# EasyEDA Pro project 自动分拣系统V1.epro

# Schematic Schematic1
Create Date: 2025-10-03; Page Name: P1; Project Name: 自动分拣系统; Schematic Name: Schematic1; Update Date: 2025-10-03; Company: 嘉立创EDA; Page Size: A4; Version: V1.0
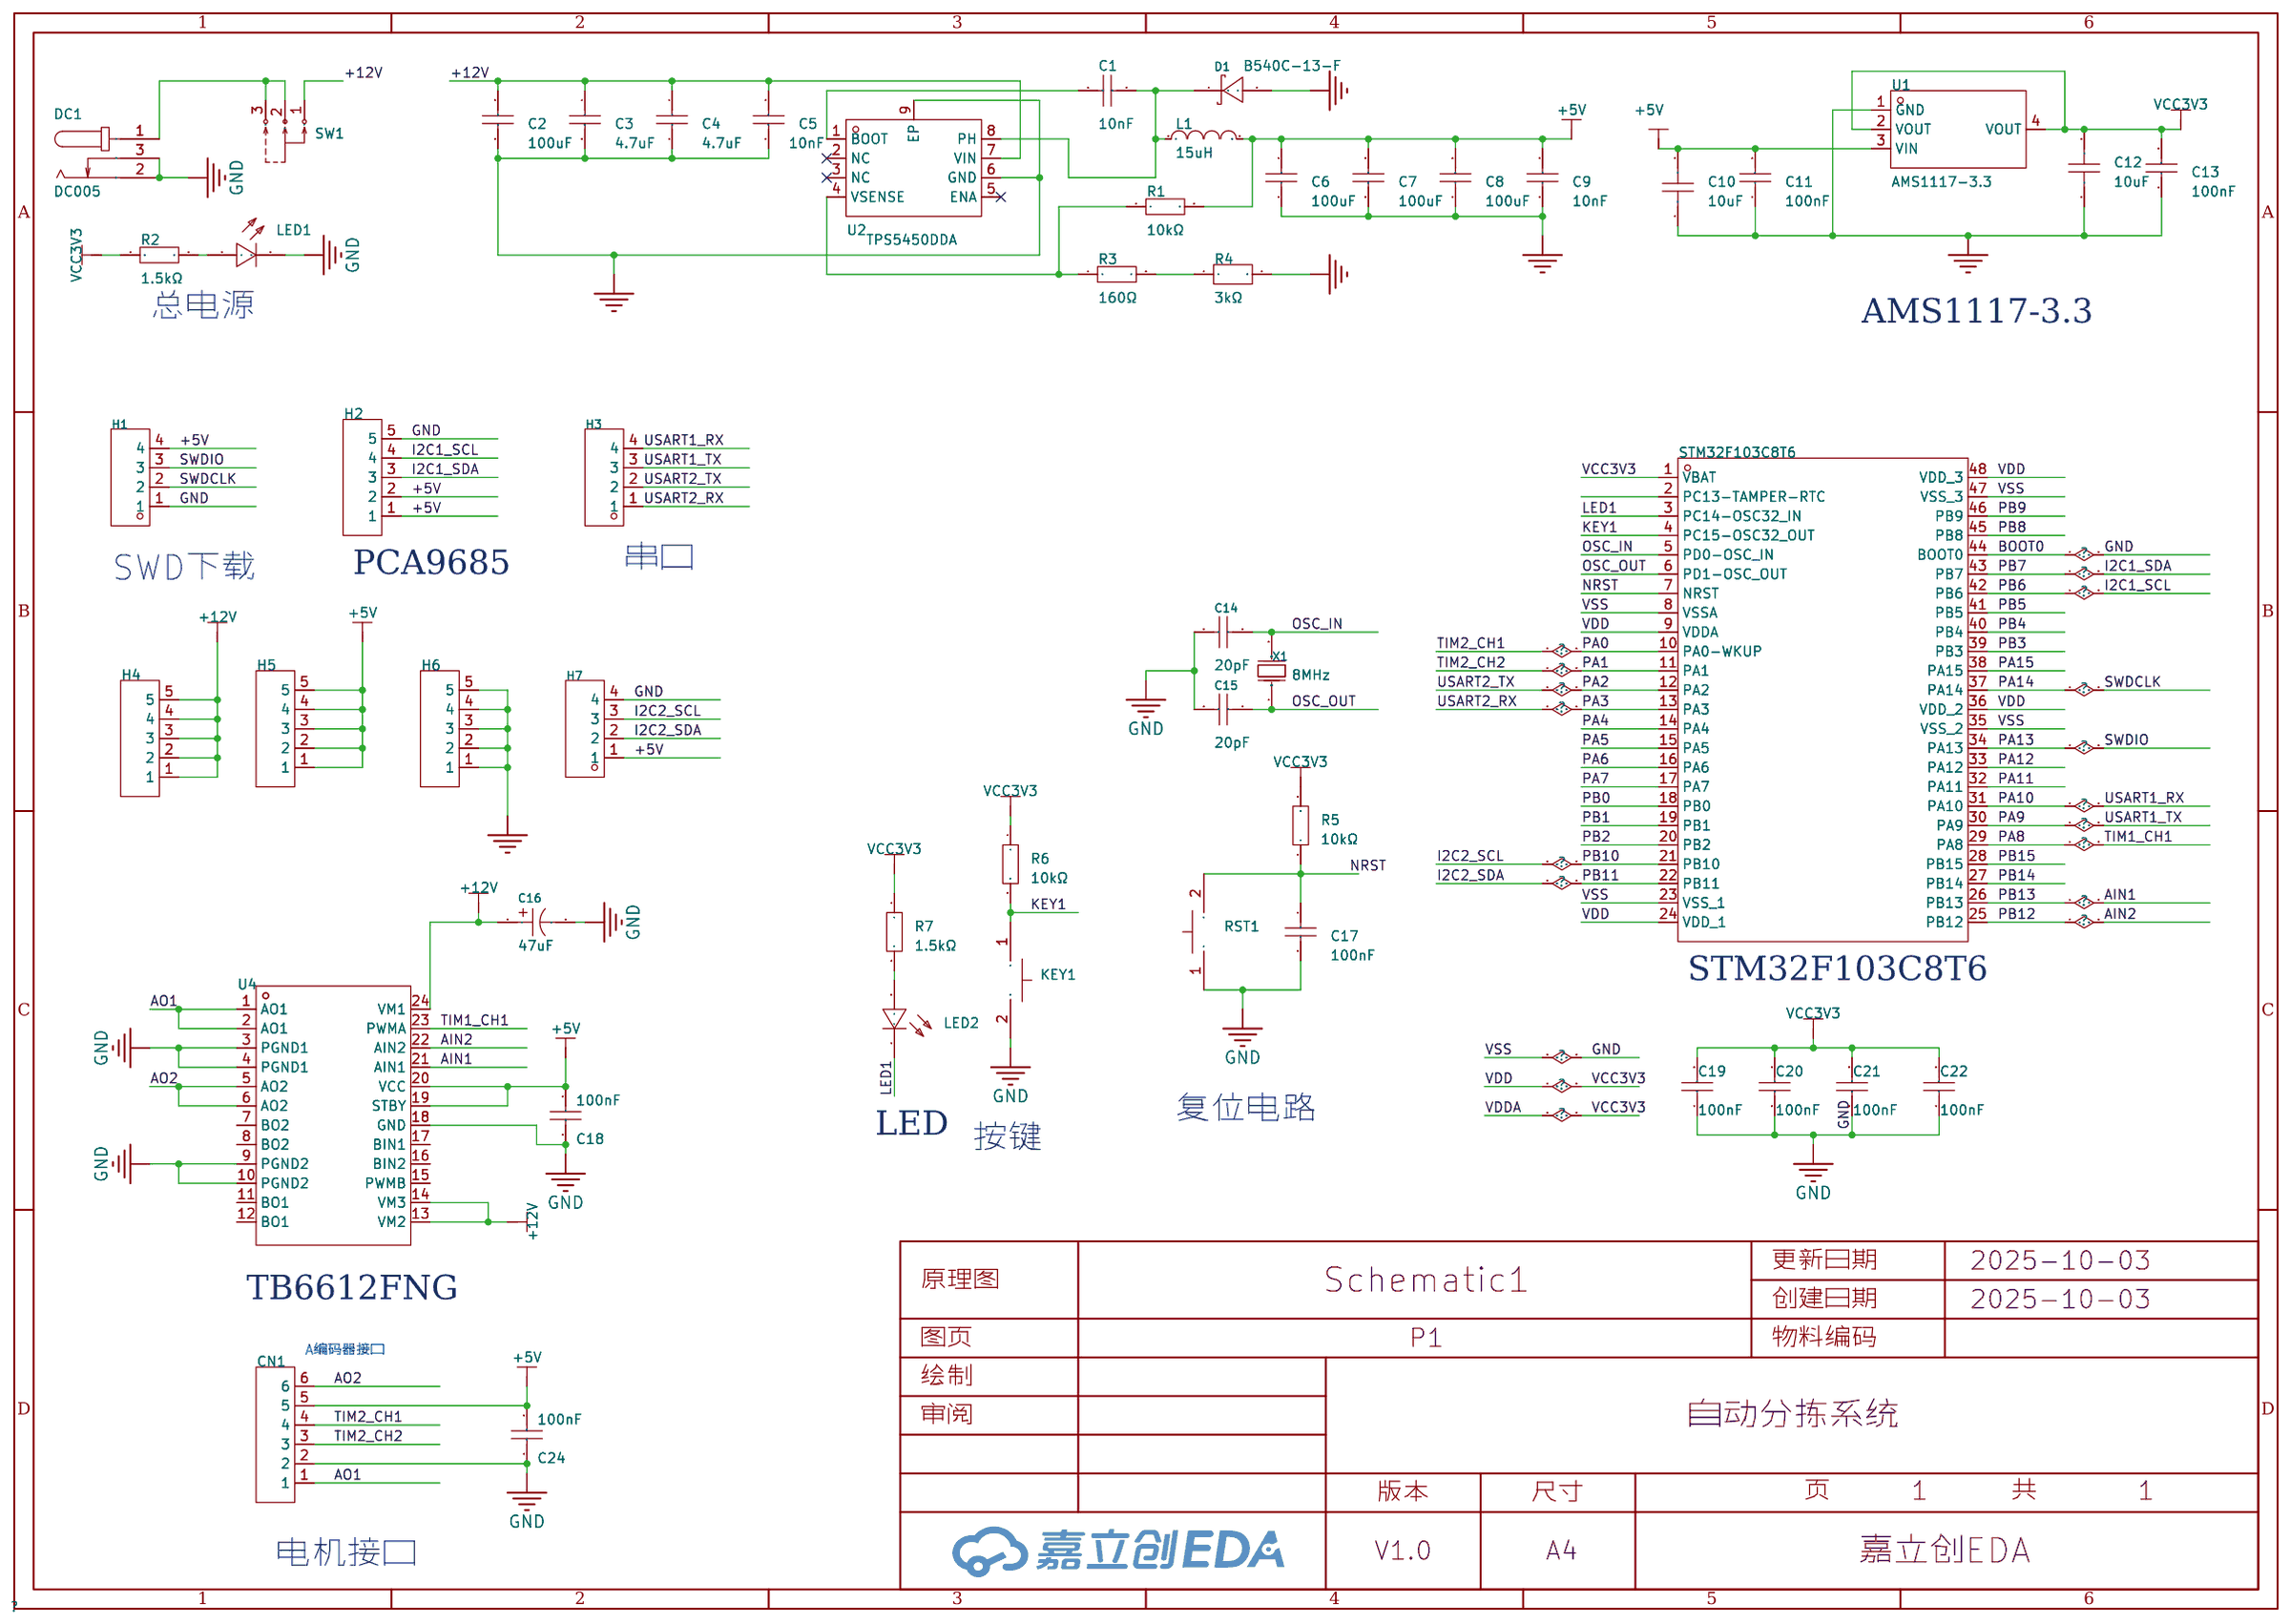
[diagram p0: schematic sheet]

## Parts
C1  10nF  [C0603]
C2  100uF  [C1206]
C3  4.7uF  [C0603]
C4  4.7uF  [C0603]
C5  10nF  [C0603]
C6  100uF  [C1206]
C7  100uF  [C1206]
C8  100uF  [C1206]
C9  10nF  [C0603]
C10  10uF  [C0603]
C11  100nF  [C0603]
C12  10uF  [C0603]
C13  100nF  [C0603]
C14  20pF  [C0603]
C15  20pF  [C0603]
C16  47uF  [CAP-SMD_BD6.3-L6.6-W6.6-LS7.2-FD]
C17  100nF  [C0603]
C18  100nF  [C0603]
C19  100nF  [C0603]
C20  100nF  [C0603]
C21  100nF  [C0603]
C22  100nF  [C0603]
C24  100nF  [C0603]
CN1  BX-PH2.0-6PWZ  [CONN-TH_6P-P2.00_BX-PH2.0-6PWZ]
D1  B540C-13-F  [SMC_L7.1-W6.2-LS8.1-RD]
DC1  DC005  [DC-IN-TH_DC005]
H1  PZ254V-11-04P  [HDR-TH_4P-P2.54-V-M]
H2  PZ254V-11-05P  [HDR-TH_5P-P2.54-V-M]
H3  PZ254V-11-04P  [HDR-TH_4P-P2.54-V-M]
H4  PZ254V-11-05P  [HDR-TH_5P-P2.54-V-M]
H5  PZ254V-11-05P  [HDR-TH_5P-P2.54-V-M]
H6  PZ254V-11-05P  [HDR-TH_5P-P2.54-V-M]
H7  PZ254V-11-04P  [HDR-TH_4P-P2.54-V-M]
KEY1  3*6*5贴片-2P  [SW-SMD_L6.0-W3.5-LS8.0]
L1  15uH  [IND-SMD_L7.0-W6.6_FXL0630]
LED1  NCD0603G1  [LED0603-RD]
LED2  NCD0603G1  [LED0603-RD]
R1  10kΩ  [R0603]
R2  1.5kΩ  [R0603]
R3  160Ω  [R0603]
R4  3kΩ  [R0603]
R5  10kΩ  [R0603]
R6  10kΩ  [R0603]
R7  1.5kΩ  [R0603]
RST1  3*6*5贴片-2P  [SW-SMD_L6.0-W3.5-LS8.0]
SW1  SS12D10/G5/直角  [SW-TH_SHOU-HAN_SS12D10G4]
U1  AMS1117-3.3  [SOT-223-3_L6.5-W3.4-P2.30-LS7.0-BR]
U2  TPS5450DDA  [SOP-8_L4.9-W3.9-P1.27-LS6.0-TL-EP-1]
U3  STM32F103C8T6  [LQFP-48_L7.0-W7.0-P0.50-LS9.0-BL]
U4  TB6612FNG,C,8,EL  [SSOP-24_L8.3-W5.6-P0.65-LS7.6-BL]
X1  8MHz  [CRYSTAL-SMD_4P-L3.2-W2.5-BL_SIT8008BI]

## Library data of the parts
C1 C5 C9 = CC0603KRX7R9BB103: 容值:10nF;精度:±10%;额定电压:50V;材质(温度系数):X7R;; LCSC Part Name: 10nF ±10% 50V; Supplier Part: C100042; Manufacturer: YAGEO(国巨); Supplier Footprint: 0603; JLCPCB Part Class: 扩展库; Datasheet: https://atta.szlcsc.com/upload/public/pdf/source/20181008/C309510_22F155564471FAF6A489F7D68F34234E.pdf; Supplier: LCSC; Tolerance: ±10%; Voltage Rated: 50V; Temperature Coefficient: X7R
C2 C6-C8 = CL31A107MQHNNNE: 容值:100uF;精度:±20%;额定电压:6.3V;材质(温度系数):X5R;; LCSC Part Name: 100uF ±20% 6.3V; Supplier Part: C15008; Manufacturer: SAMSUNG(三星); Supplier Footprint: 1206; JLCPCB Part Class: 基础库; Datasheet: https://atta.szlcsc.com/upload/public/pdf/source/20160218/1457707763339.pdf; Supplier: LCSC; Tolerance: ±20%; Voltage Rated: 6.3V; Temperature Coefficient: X5R
C3 C4 = CL10A475KA8NQNC: 容值:4.7uF;精度:±10%;额定电压:25V;材质(温度系数):X5R;; LCSC Part Name: 4.7uF ±10% 25V; Supplier Part: C69335; Manufacturer: SAMSUNG(三星); Supplier Footprint: 0603; JLCPCB Part Class: 扩展库; Datasheet: https://atta.szlcsc.com/upload/public/pdf/source/20161108/1478586410580.pdf; Supplier: LCSC; Tolerance: ±10%; Voltage Rated: 25V; Temperature Coefficient: X5R
C10 C12 = GRM21BR61H106KE43L: 容值:10uF;精度:±10%;额定电压:50V;材质(温度系数):X5R;; LCSC Part Name: 10uF ±10% 50V; Supplier Part: C440198; Manufacturer: muRata(村田); Supplier Footprint: 0805; JLCPCB Part Class: 基础库; Datasheet: https://atta.szlcsc.com/upload/public/pdf/source/20230811/95AAE0C9AF55EDC31B7A4D8B733F534E.pdf; Supplier: LCSC; Tolerance: ±10%; Voltage Rated: 50V; Temperature Coefficient: X5R
C11 C13 = 0603B104K500NT: 容值:100nF;精度:±10%;额定电压:50V;材质(温度系数):X7R;; LCSC Part Name: 100nF ±10% 50V; Supplier Part: C30926; Manufacturer: FH(风华); Supplier Footprint: 0603; JLCPCB Part Class: 扩展库; Datasheet: https://atta.szlcsc.com/upload/public/pdf/source/20200305/C486355_26A10D38EF8C2A5C37091D0039909270.pdf; Supplier: LCSC; Tolerance: ±10%; Voltage Rated: 50V; Temperature Coefficient: X7R
C14 C15 = CL10C200JB8NNNC: 容值:20pF;精度:±5%;额定电压:50V;材质(温度系数):C0G;; LCSC Part Name: 20pF ±5% 50V; Supplier Part: C1648; Manufacturer: SAMSUNG(三星); Supplier Footprint: 0603; JLCPCB Part Class: Basic Part; Datasheet: https://atta.szlcsc.com/upload/public/pdf/source/20160218/1457707763339.pdf; Supplier: LCSC; Tolerance: ±5%; Voltage Rated: 50V; Temperature Coefficient: C0G
C16 = RVT47UF35V67RV0039: 容值:47uF;额定电压:35V;电容体直径:-;电容体长度:-;纹波电流:-;等效串联电阻:-;工作寿命:2000hrs@105℃;; LCSC Part Name: 47uF 35V; Supplier Part: C2836440; Manufacturer: KNSCHA(科尼盛); Supplier Footprint: SMD,6.3x5.4mm; JLCPCB Part Class: 扩展库; Supplier: LCSC; Rated Voltage: 35V; Lifetime @ Temp: 2000hrs@105℃
C17 C18 C24 = 0603B104K500NT: 容值:100nF;精度:±10%;额定电压:50V;材质(温度系数):X7R;; LCSC Part Name: 100nF ±10% 50V; Supplier Part: C30926; Manufacturer: FH(风华); Supplier Footprint: 0603; JLCPCB Part Class: 扩展库; Datasheet: https://atta.szlcsc.com/upload/public/pdf/source/20170923/C30926_1506149436298988724.pdf; Supplier: LCSC; Tolerance: ±10%; Voltage Rated: 50V; Temperature Coefficient: X7R
C19-C22 = 0603B104K500NT: 容值:100nF;精度:±10%;额定电压:50V;材质(温度系数):X7R;; LCSC Part Name: 100nF ±10% 50V; Supplier Part: C30926; Manufacturer: FH(风华); Supplier Footprint: 0603; JLCPCB Part Class: Extended Part; Datasheet: https://atta.szlcsc.com/upload/public/pdf/source/20200305/C486355_26A10D38EF8C2A5C37091D0039909270.pdf; Supplier: LCSC; Tolerance: ±10%; Voltage Rated: 50V; Temperature Coefficient: X7R
CN1 = BX-PH2.0-6PWZ: 插针结构:1x6P;间距:2mm;安装方式:弯插;参考系列:PH;总PIN数:6P;排数:1;每排PIN数:6;行距:-;额定电流:2A;触头材质:黄铜;触头镀层:锡;工作温度:-25℃~+85℃;; LCSC Part Name: 1x6P 间距:2mm 弯插 系列:PH; Supplier Part: C18077757; Manufacturer: Bossie(博锡); Supplier Footprint: 弯插,P=2mm; JLCPCB Part Class: 扩展库; Datasheet: https://item.szlcsc.com/datasheet/BX-PH2.0-6PWZ/19218158.html; Supplier: LCSC; Pins Structure: 1x6P; Pitch: 2mm; Mounting Type: 弯插; Reference Series: PH; Number of Pins: 6P; Number of Rows: 1; Number of PINs Per Row: 6; Current Rating: 2A; Contact Material: 黄铜; Contact Plating: 锡; Operating Temperature: -25℃~+85℃; Voltage Rating: 250V; Plastic Material: PA66; Flame Retardant Rating: UL94V-0; Color: 白色; Z-Height of the Board: 4.7mm; X-Length of Bottom Edge on Board (Spacing Line): 14mm; Y-Width of Bottom Edge on Board: 6.05mm
D1 = B540C-13-F: 直流反向耐压(Vr):40V;平均整流电流(Io):5A;正向压降(Vf):550mV@5A;; LCSC Part Name: 电压:40V 电流:5A; Supplier Part: C72264; Manufacturer: DIODES(美台); Supplier Footprint: SMC(DO-214AB); JLCPCB Part Class: 扩展库; Datasheet: https://atta.szlcsc.com/upload/public/pdf/source/20171023/C134461_15087453602301052556.pdf; Supplier: LCSC; Reverse Voltage (Vr): 40V; Average Rectified Current (Io): 5A; Forward Voltage (Vf@If): 550mV@5A; Reverse Leakage Current (Ir): 500uA@40V
DC1 = DC005: 连接器类型:DC电源插座;安装方式:弯插;触点内径:2mm;触点外径:6.3mm;额定电流:500mA;额定电压:30V;工作温度范围:-40℃~+55℃;; LCSC Part Name: DC电源插座 内径:2mm 外径:6.3mm; Supplier Part: C431533; Manufacturer: SHOU HAN(首韩); Supplier Footprint: 插件; JLCPCB Part Class: 扩展库; Datasheet: https://atta.szlcsc.com/upload/public/pdf/source/20190925/C431533_4751811035784AC1D38EBC85F7905E99.pdf; Supplier: LCSC; Connector Type: DC电源插座; Mounting Style: 弯插; Inside Contact Diameter: 2mm; Outside Contact Diameter: 6.3mm; Current Rating (Max): 500mA; Voltage Rating (Max): 30V; Operating Temperature Range: -40℃~+55℃
H1 H3 H7 = PZ254V-11-04P: 排数:单排;总PIN位数:4P;间距:2.54mm;插针结构:1x4P;行距:-;安装类型:直插;圆针/方针:方针;额定电流:3A;额定电压:250V;配合针长度:6mm;塑高:2.5mm;端接针长度:3mm;触头材质:-;工作温度范围:-40℃~+105℃;颜色:黑色;; LCSC Part Name: 2.54mm 1x4P 直插 方针; Supplier Part: C2691448; Manufacturer: XFCN(兴飞); Supplier Footprint: 插件,P=2.54mm; JLCPCB Part Class: 扩展库; Datasheet: https://atta.szlcsc.com/upload/public/pdf/source/20200309/C492403_F9F19131791D08044AD4F84F8E751A34.pdf; Supplier: LCSC; Number of Rows: 单排; Number of Pins: 4P; Pitch: 2.54mm; Pin Structure: 1x4P; Mounting Type: 直插; Circluar Pins/Square Pins: 方针; Current Rating (Max): 3A; Voltage Rating (Max): 250V; Length of Mating Pin: 6mm; Insulation Height: 2.5mm; Length of End Connection Pin: 3mm; Operating Temperature Range: -40℃~+105℃; Color: 黑色
H2 H4-H6 = PZ254V-11-05P: 插针结构:1x5P;间距:2.54mm;行距:-;圆针/方针:方针;安装方式:直插;排数:单排;总PIN位数:5P;额定电流:-;额定电压:-;配合针长度:6mm;塑高:2.5mm;端接针长度:3mm;触头材质:黄铜;触头镀层:-;工作温度:-40℃~+105℃;颜色:黑色;; LCSC Part Name: 1x5P 间距:2.54mm 方针 直插; Supplier Part: C492404; Manufacturer: XFCN(兴飞); Supplier Footprint: 插件,P=2.54mm; JLCPCB Part Class: 扩展库; Datasheet: https://atta.szlcsc.com/upload/public/pdf/source/20200309/C492404_E51533260F8710EFF5D4617281164C1D.pdf; Supplier: LCSC; Pin Structure: 1x5P; Pitch: 2.54mm; Circluar Pins/Square Pins: 方针; Mounting Type: 直插; Number of Rows: 单排; Number of Pins: 5P; Length of Mating Pin: 6mm; Insulation Height: 2.5mm; Length of End Connection Pin: 3mm; Contact Material: 黄铜; Operating Temperature: -40℃~+105℃; Color: 黑色
KEY1 RST1 = 3*6*5贴片-2P: Supplier Part: C9900011307; Supplier Footprint: SW-SMD; JLCPCB Part Class: 扩展库; Supplier: LCSC
L1 = FXL0630-150-M: 电感值:15uH;精度:±20%;额定电流:3A;类型:一体成型电感;饱和电流(Isat):4.5A;; LCSC Part Name: 15uH ±20% 4.5A; Supplier Part: C177243; Manufacturer: cjiang(长江微电); Supplier Footprint: SMD,6.6x7mm; JLCPCB Part Class: 扩展库; Datasheet: https://atta.szlcsc.com/upload/public/pdf/source/20230516/3A080F5AF8C87BB81C3BA86E5F60E51A.pdf; Supplier: LCSC; Tolerance: ±20%; Rated Current: 3A; Type: 一体成型电感; DC Resistance (DCR): 115mΩ; Saturation Current (Isat): 4.5A
LED1 LED2 = NCD0603G1: 发光颜色:翠绿色;正向电压(VF):2.6V~3.6V;功率:72mW;正向电流:10mA;主波长:515nm~530nm;透镜颜色:无色透明;发光强度:330mcd~900mcd;发光角度:130°;工作温度:-30℃~+85℃;; Supplier Part: C84267; Manufacturer: 国星光电; Supplier Footprint: 0603; JLCPCB Part Class: 扩展库; Datasheet: https://atta.szlcsc.com/upload/public/pdf/source/20200820/C84267_04BA7703640BAC111D09F5EFB971FBF3.pdf; Supplier: LCSC; Emitted Color: 翠绿色; Forward Voltage (VF): 2.6V~3.6V; Power Dissipation: 72mW; Forward Current: 10mA; Dominant Wavelength: 515nm~530nm; Lens Color: 无色透明; Luminous Intensity: 330mcd~900mcd; Viewing Angle: 130°; Operating Temperature: -30℃~+85℃
R1 R5 R6 = 0603WAF1002T5E: 阻值:10kΩ;精度:±1%;功率:100mW;温度系数:±100ppm/℃;电阻类型:厚膜电阻;; LCSC Part Name: 10kΩ ±1% 100mW 厚膜电阻; Supplier Part: C25804; Manufacturer: UNI-ROYAL(厚声); Supplier Footprint: 0603; JLCPCB Part Class: 基础库; Datasheet: https://atta.szlcsc.com/upload/public/pdf/source/20200306/C422600_1E6D84923E4A46A82E41ADD87F860B5C.pdf; Supplier: LCSC; Tolerance: ±1%; Power(Watts): 100mW; Overload Voltage (Max): 75V; Temperature Coefficient: ±100ppm/℃; Type: 厚膜电阻; Operating Temperature Range: -55℃~+155℃
R2 R7 = 0603WAF1501T5E: 阻值:1.5kΩ;精度:±1%;功率:100mW;温度系数:±100ppm/℃;电阻类型:厚膜电阻;; LCSC Part Name: 1.5kΩ ±1% 100mW 厚膜电阻; Supplier Part: C22843; Manufacturer: UNI-ROYAL(厚声); Supplier Footprint: 0603; JLCPCB Part Class: 基础库; Datasheet: https://atta.szlcsc.com/upload/public/pdf/source/20200306/C422600_1E6D84923E4A46A82E41ADD87F860B5C.pdf; Supplier: LCSC; Tolerance: ±1%; Power(Watts): 100mW; Overload Voltage (Max): 75V; Temperature Coefficient: ±100ppm/℃; Type: 厚膜电阻; Operating Temperature Range: -55℃~+155℃
R3 = 0603WAF0000T5E: 阻值:0Ω;精度:±1%;功率:100mW;电阻类型:厚膜电阻;; LCSC Part Name: 0Ω ±1% 100mW 厚膜电阻; Supplier Part: C21189; Manufacturer: UNI-ROYAL(厚声); Supplier Footprint: 0603; JLCPCB Part Class: 基础库; Datasheet: https://atta.szlcsc.com/upload/public/pdf/source/20200306/C422600_1E6D84923E4A46A82E41ADD87F860B5C.pdf; Supplier: LCSC; Tolerance: ±1%; Power(Watts): 100mW; Overload Voltage (Max): 75V; Type: 厚膜电阻; Operating Temperature Range: -55℃~+155℃
R4 = FRC0603F3161TS: 阻值:3.16kΩ;精度:±1%;功率:100mW;温度系数:±100ppm/℃;电阻类型:厚膜电阻;; LCSC Part Name: 3.16kΩ ±1% 100mW 厚膜电阻; Supplier Part: C2930087; Manufacturer: FOJAN(富捷); Supplier Footprint: 0603; JLCPCB Part Class: 扩展库; Datasheet: https://atta.szlcsc.com/upload/public/pdf/source/20211221/925EC7D7225764EE0046F22065062C87.pdf; Supplier: LCSC; Tolerance: ±1%; Power(Watts): 100mW; Overload Voltage (Max): 75V; Temperature Coefficient: ±100ppm/℃; Type: 厚膜电阻; Operating Temperature Range: -55℃~+155℃
SW1 = SS12D10/G5/直角: Supplier Part: C9900029541; Supplier Footprint: THrough hole; JLCPCB Part Class: 扩展库; Supplier: LCSC
U1 = AMS1117-3.3_C6186: 输出类型:固定;最大输入电压:-;输出电压:3.3V;输出电流:1A;电源纹波抑制比(PSRR):72dB@(120Hz);输出极性:正;; LCSC Part Name: 输出3.3V 1A; Supplier Part: C6186; Manufacturer: AMS; Supplier Footprint: SOT-223-3; JLCPCB Part Class: 基础库; Datasheet: https://atta.szlcsc.com/upload/public/pdf/source/20180727/C6186_7A095716F0823C02F1997A905E26C086.pdf; Supplier: LCSC; Output Type: 固定; Output Voltage: 3.3V; Output Current: 1A; Power Supply Rejection Ratio (PSRR): 72dB@(120Hz); Dropout Voltage: 1.3V@(800mA); Output Polarity: 正; Number of Outputs: 1
U2 = TPS5450DDA: 功能类型:降压型;同步整流:否;输出类型:可调;输出通道数:1;拓扑结构:降压式;输入电压:5.5V~36V;输出电压:1.221V~31.32V;输出电流(最大值):5A;开关频率:500kHz;工作温度:-40℃~+125℃@(TJ);; LCSC Part Name: 降压型 Vin=5.5V~36V Vout=1.221V~31.32V 5A; Supplier Part: C1355315; Manufacturer: TI(德州仪器); Supplier Footprint: Power-Pad-SO-8; JLCPCB Part Class: 扩展库; Supplier: LCSC; Function: 降压型; Synchronous Rectification: 否; Output Type: 可调; Number of Outputs: 1; Topology: 降压式; Input Voltage: 5.5V~36V; Output Voltage: 1.221V~31.32V; Output Current (Max): 5A; Switching Frequency: 500kHz; Operating Temperature: -40℃~+125℃@(TJ)
U3 = STM32F103C8T6: CPU内核:ARM Cortex-M3;CPU最大主频:72MHz;程序存储容量:64KB;程序存储器类型:FLASH;RAM总容量:20KB;GPIO端口数量:37;ADC(位数):12bit;工作温度范围:-40℃~+85℃;; LCSC Part Name: ARM Cortex-M3 72MHz MSL=3; Supplier Part: C8734; Manufacturer: ST(意法半导体); Supplier Footprint: LQFP-48(7x7); JLCPCB Part Class: 基础库; Datasheet: https://atta.szlcsc.com/upload/public/pdf/source/20220812/8363ACEC51AD55ECEB84799464F7CB85.pdf; Supplier: LCSC; CPU Core: ARM Cortex-M3; CPU Maximum Speed: 72MHz; Operating Voltage Range: 2V~3.6V; Program Storage Size: 64KB; Program Memory Type: FLASH; RAM Size: 20KB; EEPROM: 64KB; GPIO Ports Number: 37; ADC (Bit): 12bit; Peripheral/Function: 看门狗；DMA；看门狗；片载温度传感器; Internal Oscillator: 有; Operating Temperature Range: -40℃~+85℃
U4 = TB6612FNG,C,8,EL: 类型:有刷直流电机;电源电压:2.7V~5.5V;输出电流:1A;接口:并行;; Supplier Part: C141517; Manufacturer: TOSHIBA(东芝); Supplier Footprint: SSOP-24; JLCPCB Part Class: 扩展库; Datasheet: https://atta.szlcsc.com/upload/public/pdf/source/20171128/C141517_15118625624231147036.pdf; Supplier: LCSC; Type: 有刷直流电机; Supply Voltage: 2.7V~5.5V; Output Current: 1A; Interface: 并行; Operating Temperature: -20℃~+85℃@(Ta)
X1 = X49SD8MSD2SC: 晶振类型:直插晶振;频率:8MHz;常温频差:±20ppm;外接负载电容:20pF;频率稳定度(全温):±30ppm;; LCSC Part Name: 8MHz ±20ppm 20pF; Supplier Part: C21263; Manufacturer: YXC(扬兴晶振); Supplier Footprint: HC-49S; JLCPCB Part Class: Extended Part; Datasheet: https://atta.szlcsc.com/upload/public/pdf/source/20210903/A997D130AE99CBB55D9024F9BE6DA174.pdf; Supplier: LCSC; Crystal Type: 直插晶振; Normal temperature Frequency Tolerance: ±20ppm; External load capacitor: 20pF; Frequency Stability(Full temperature range): ±30ppm; Operating Temperature: -20℃~+70℃; Frequency Tolerance: ±10ppm; Frequency Stability: ±50ppm; Load Capacitance: 20pF

## Nets
+5V: C6.2 C7.2 C8.2 C9.2 C10.2 C11.2 C18.1 C24.1 CN1.5 H1.4 H2.1 H2.2 H5.1 H5.2 H5.3 H5.4 H5.5 H7.1 L1.2 R1.2 U1.3(VIN) U4.19(STBY) U4.20(VCC)
+12V: C2.2 C3.1 C4.1 C5.2 C16.1 H4.1 H4.2 H4.3 H4.4 H4.5 SW1.1 U2.7(VIN) U4.13(VM2) U4.14(VM3) U4.24(VM1)
GND: C2.1 C3.2 C4.2 C5.1 C6.1 C7.1 C8.1 C9.1 C10.1 C11.1 C12.1 C13.1 C14.2 C15.2 C16.2 C17.2 C18.2 C19.1 C20.1 C21.1 C22.1 C24.2 CN1.2 D1.2(A) DC1.2 DC1.3 H1.1 H2.5 H6.1 H6.2 H6.3 H6.4 H6.5 H7.4 KEY1.2 LED1.1(K) R4.2 RST1.1 U1.1(GND) U2.6(GND) U2.9(EP) U3.8(VSSA) U3.23(VSS_1) U3.35(VSS_2) U3.44(BOOT0) U3.47(VSS_3) U4.3(PGND1) U4.4(PGND1) U4.9(PGND2) U4.10(PGND2) U4.18(GND)
VCC3V3: C12.2 C13.2 C19.2 C20.2 C21.2 C22.2 R2.1 R5.2 R6.1 R7.1 U1.2(VOUT) U1.4(VOUT) U3.1(VBAT) U3.9(VDDA) U3.24(VDD_1) U3.36(VDD_2) U3.48(VDD_3)
AIN1: U3.26(PB13) U4.21(AIN1)
AIN2: U3.25(PB12) U4.22(AIN2)
AO1: CN1.1 U4.1(AO1) U4.2(AO1)
AO2: CN1.6 U4.5(AO2) U4.6(AO2)
I2C1_SCL: H2.4 U3.42(PB6)
I2C1_SDA: H2.3 U3.43(PB7)
I2C2_SCL: H7.3 U3.21(PB10)
I2C2_SDA: H7.2 U3.22(PB11)
KEY1: KEY1.1 R6.2 U3.4(PC15-OSC32_OUT)
LED1: LED2.1(K) U3.3(PC14-OSC32_IN)
NRST: C17.1 R5.1 RST1.2 U3.7(NRST)
OSC_IN: C14.1 U3.5(PD0-OSC_IN) X1.2(OSC2)
OSC_OUT: C15.1 U3.6(PD1-OSC_OUT) X1.1(OSC1)
PA0: CN1.4 U3.10(PA0-WKUP)
PA1: CN1.3 U3.11(PA1)
PA2: H3.2 U3.12(PA2)
PA3: H3.1 U3.13(PA3)
PA4: U3.14(PA4)
PA5: U3.15(PA5)
PA6: U3.16(PA6)
PA7: U3.17(PA7)
PA8: U3.29(PA8) U4.23(PWMA)
PA9: H3.3 U3.30(PA9)
PA10: H3.4 U3.31(PA10)
PA11: U3.32(PA11)
PA12: U3.33(PA12)
PA13: H1.3 U3.34(PA13)
PA14: H1.2 U3.37(PA14)
PA15: U3.38(PA15)
PB0: U3.18(PB0)
PB1: U3.19(PB1)
PB2: U3.20(PB2)
PB3: U3.39(PB3)
PB4: U3.40(PB4)
PB5: U3.41(PB5)
PB8: U3.45(PB8)
PB9: U3.46(PB9)
PB14: U3.27(PB14)
PB15: U3.28(PB15)
$1N3060: LED1.2(A) R2.2
$1N3483: LED2.2(A) R7.2
$1N5689: R3.2 R4.1
$1N5690: R1.1 R3.1 U2.4(VSENSE)
$1N5697: C1.2 U2.1(BOOT)
$1N5698: C1.1 D1.1(K) L1.1 U2.8(PH)
$1N11600: DC1.1 SW1.2 SW1.3

Not connected (* = marked no-connect by the designer): U2 2(NC)* 3(NC)* 5(ENA)*; U3 2(PC13-TAMPER-RTC); U4 7(BO2) 8(BO2) 11(BO1) 12(BO1) 15(PWMB) 16(BIN2) 17(BIN1)

## Notes on the sheet
- 总电源
- AMS1117-3.3
- SWD下载
- PCA9685
- 串口
- STM32F103C8T6
- 复位电路
- LED
- 按键
- TB6612FNG
- A编码器接口
- 电机接口

# Board PCB1
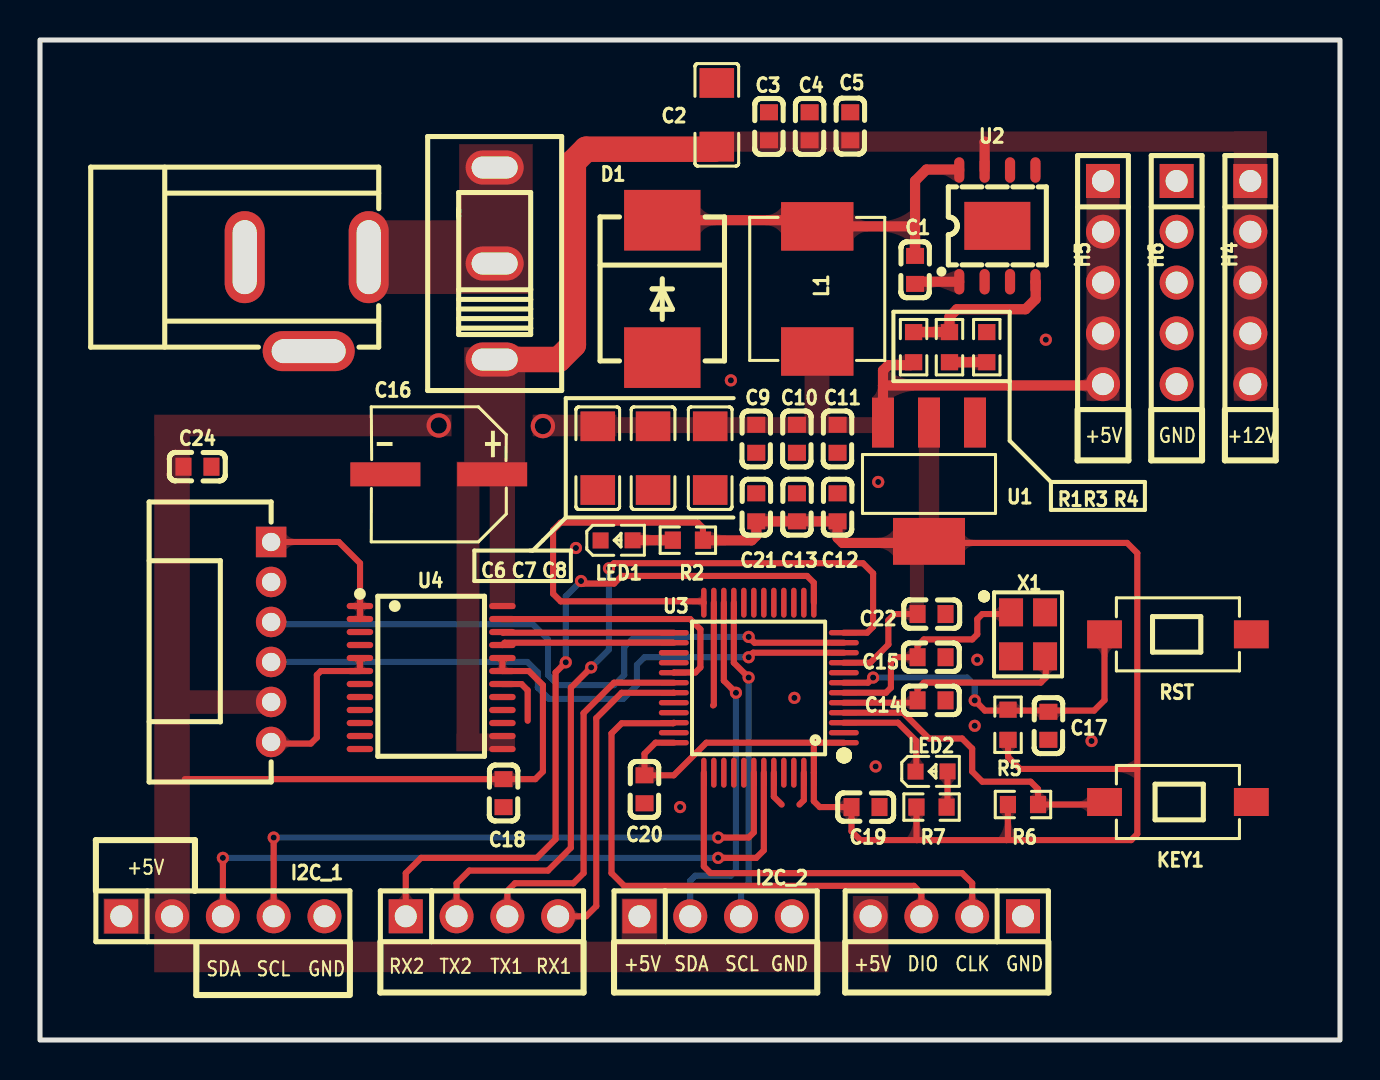
[diagram p1: board, top side]
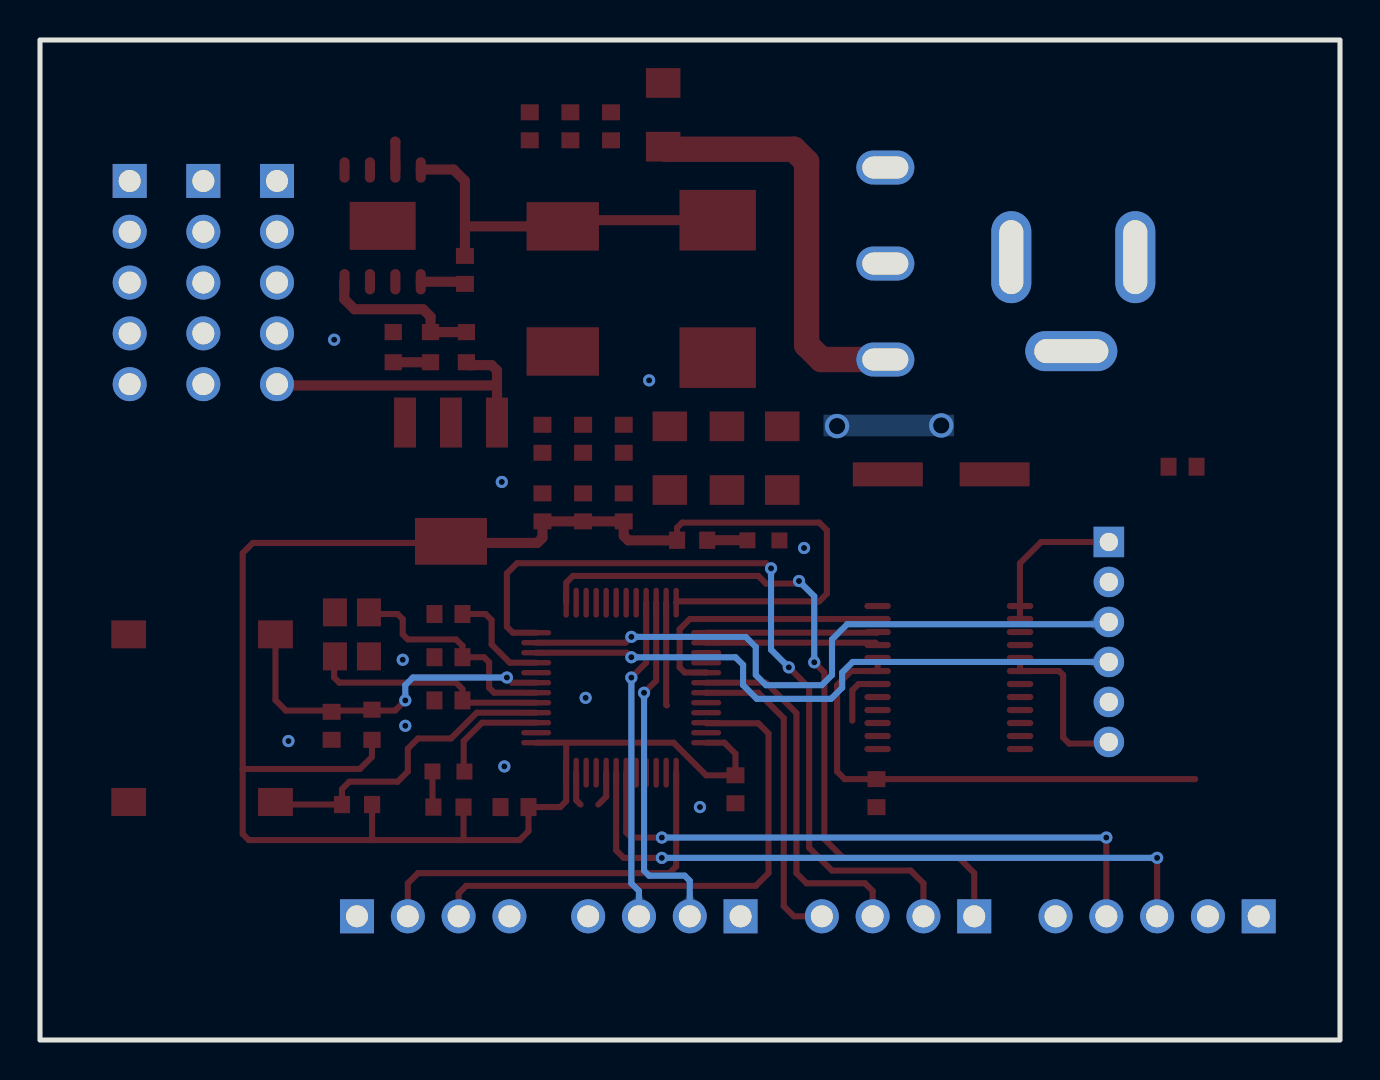
[diagram p2: board, bottom side, seen from below]

Outline 65 x 50 mm; copper layers: Top Layer, Bottom Layer. Coordinates in mm from the lower left corner of the outline.
Outline path: rectangle 0,50 65,0
Stack: Top Layer 0.035mm / Dielectric1 1.51mm FR4 er 4.5 / Bottom Layer 0.035mm

## Design rules (mm)
template: JLCPCB Capability(Two Layers Board)
spacing copperThickness1oz (default): track to track 0.102, other pairs 0.152 to 0.3
spacing copperThickness2oz: track to track 0.203, other pairs 0.152 to 0.3
track width copperThickness1oz (default): min 0.127, default 0.254, max 2.54
track width copperThickness2oz: min 0.203, default 0.254, max 2.54
differential pair differentialPair (default): width min 0.127, default 0.254, max 2.54; gap min 0.152, default 0.152
via viaSize (default): diameter min 0.5, default 0.61, max 10; hole min 0.3, default 0.305, max 6.3

## Placement (name value [footprint] x y rotation side)
C1  10nF  [C0603]  43.75 38.5 270 top
C2  100uF  [C1206]  33.84 46.26 270 top
C3  4.7uF  [C0603]  36.45 45.68 90 top
C4  4.7uF  [C0603]  38.48 45.68 90 top
C5  10nF  [C0603]  40.51 45.68 270 top
C6  100uF  [C1206]  27.89 29.09 90 top
C7  100uF  [C1206]  30.65 29.09 90 top
C8  100uF  [C1206]  33.51 29.09 90 top
C9  10nF  [C0603]  35.81 30.06 90 top
C10  10uF  [C0603]  37.85 30.06 90 top
C11  100nF  [C0603]  39.88 30.06 90 top
C12  10uF  [C0603]  39.88 26.63 270 top
C13  100nF  [C0603]  37.85 26.63 270 top
C14  20pF  [C0603]  44.58 16.98 0 top
C15  20pF  [C0603]  44.58 19.14 0 top
C16  47uF  [CAP-SMD_BD6.3-L6.6-W6.6-LS7.2-FD]  19.94 28.28 180 top
C17  100nF  [C0603]  50.42 15.71 270 top
C18  100nF  [C0603]  23.18 12.34 270 top
C19  100nF  [C0603]  41.27 11.65 180 top
C20  100nF  [C0603]  30.23 12.53 90 top
C21  100nF  [C0603]  35.81 26.63 270 top
C22  100nF  [C0603]  44.58 21.3 180 top
C24  100nF  [C0603]  7.87 28.66 0 top
CN1  BX-PH2.0-6PWZ  [CONN-TH_6P-P2.00_BX-PH2.0-6PWZ]  11.56 19.9 270 top
D1  B540C-13-F  [SMC_L7.1-W6.2-LS8.1-RD]  31.11 37.55 270 top
DC1  DC005  [DC-IN-TH_DC005]  13.34 36.79 0 top
H4  PZ254V-11-05P  [HDR-TH_5P-P2.54-V-M]  60.52 37.87 270 top
H5  PZ254V-11-05P  [HDR-TH_5P-P2.54-V-M]  53.15 37.87 270 top
H6  PZ254V-11-05P  [HDR-TH_5P-P2.54-V-M]  56.83 37.87 270 top
I2C_1  PZ254V-11-05P  [HDR-TH_5P-P2.54-V-M]  9.14 6.18 0 top
I2C_2  PZ254V-11-04P  [HDR-TH_4P-P2.54-V-M]  33.78 6.18 0 top
KEY1  3*6*5贴片-2P  [SW-SMD_L6.0-W3.5-LS8.0]  56.9 11.9 0 top
L1  15uH  [IND-SMD_L7.0-W6.6_FXL0630]  38.86 37.55 90 top
LED1  NCD0603G1  [LED0603-RD]  28.83 24.98 0 top
LED2  NCD0603G1  [LED0603-RD]  44.58 13.42 0 top
NOREF  -  [HDR-TH_4P-P2.54-V-M]  45.34 6.18 180 top
R1  10kΩ  [R0603]  43.68 34.64 270 top
R2  1.5kΩ  [R0603]  32.39 24.99 180 top
R3  160Ω  [R0603]  45.47 34.64 270 top
R4  3kΩ  [R0603]  47.34 34.64 90 top
R5  10kΩ  [R0603]  48.4 15.76 270 top
R6  10kΩ  [R0603]  49.15 11.77 0 top
R7  1.5kΩ  [R0603]  44.58 11.65 0 top
RST  3*6*5贴片-2P  [SW-SMD_L6.0-W3.5-LS8.0]  56.9 20.28 180 top
SW1  SS12D10/G5/直角  [SW-TH_SHOU-HAN_SS12D10G4]  22.73 38.82 90 top
U1  AMS1117-3.3  [SOT-223-3_L6.5-W3.4-P2.30-LS7.0-BR]  44.45 27.9 90 top
U2  TPS5450DDA  [SOP-8_L4.9-W3.9-P1.27-LS6.0-TL-EP-1]  47.87 40.71 90 top
U3  STM32F103C8T6  [LQFP-48_L7.0-W7.0-P0.50-LS9.0-BL]  35.94 17.61 90 top
U4  TB6612FNG,C,8,EL  [SSOP-24_L8.3-W5.6-P0.65-LS7.6-BL]  19.56 18.12 270 top
X1  8MHz  [CRYSTAL-SMD_4P-L3.2-W2.5-BL_SIT8008BI]  49.4 20.28 270 top
串口  PZ254V-11-04P  [HDR-TH_4P-P2.54-V-M]  22.1 6.18 0 top

## Footprints (pads in the part's own frame, mm; a bottom-side part is the same pattern mirrored in y, then rotated)
C0603
  rect 0.8x0.9 smd: 1(-0.7,0) 2(0.7,0)
C1206
  rect 1.485x1.728 smd: 1(-1.593,0) 2(1.593,0)
CAP-SMD_BD6.3-L6.6-W6.6-LS7.2-FD
  rect 3.5x1.2 smd: 1(-2.67,0) 2(2.67,0)
CONN-TH_6P-P2.00_BX-PH2.0-6PWZ
  rect 1.524x1.524 hole 0.914: 1(-5,0)
  round 1.524 hole 0.914: 2(-3,0) 3(-1,0) 4(1,0) 5(3,0) 6(5,0)
CRYSTAL-SMD_4P-L3.2-W2.5-BL_SIT8008BI
  rect 1.4x1.2 smd: 1(-1.1,-0.85) 2(1.1,-0.85) 3(1.1,0.85) 4(-1.1,0.85)
DC-IN-TH_DC005
  oval 2x4.6 hole 1.2x3.7: 1(3.1,2.35) 2(-3.1,2.35)
  oval 4.6x2 hole 3.7x1.2: 3(0.1,-2.35)
HDR-TH_4P-P2.54-V-M
  rect 1.7x1.7 hole 1.1: 1(-3.81,0)
  round 1.7 hole 1.1: 2(-1.27,0) 3(1.27,0) 4(3.81,0)
HDR-TH_5P-P2.54-V-M
  rect 1.7x1.7 hole 1.1: 1(-5.08,0)
  round 1.7 hole 1.1: 2(-2.54,0) 3(0,0) 4(2.54,0) 5(5.08,0)
IND-SMD_L7.0-W6.6_FXL0630
  rect 2.424x3.62 smd: 1(3.128,0) 2(-3.128,0)
LED0603-RD
  rect 0.8x0.8 smd: 1(-0.799,-0.004) 2(0.799,0.004)
LQFP-48_L7.0-W7.0-P0.50-LS9.0-BL
  oval 0.27x1.5 smd: 1(-2.75,-4.25) 2(-2.25,-4.25) 3(-1.75,-4.25) 4(-1.25,-4.25) 5(-0.75,-4.25) 6(-0.25,-4.25) 7(0.25,-4.25) 8(0.75,-4.25) 9(1.25,-4.25) 10(1.75,-4.25) 11(2.25,-4.25) 12(2.75,-4.25) 25(2.75,4.25) 26(2.25,4.25) 27(1.75,4.25) 28(1.25,4.25) 29(0.75,4.25) 30(0.25,4.25) 31(-0.25,4.25) 32(-0.75,4.25) 33(-1.25,4.25) 34(-1.75,4.25) 35(-2.25,4.25) 36(-2.75,4.25)
  oval 1.5x0.27 smd: 13(4.25,-2.75) 14(4.25,-2.25) 15(4.25,-1.75) 16(4.25,-1.25) 17(4.25,-0.75) 18(4.25,-0.25) 19(4.25,0.25) 20(4.25,0.75) 21(4.25,1.25) 22(4.25,1.75) 23(4.25,2.25) 24(4.25,2.75) 37(-4.25,2.75) 38(-4.25,2.25) 39(-4.25,1.75) 40(-4.25,1.25) 41(-4.25,0.75) 42(-4.25,0.25) 43(-4.25,-0.25) 44(-4.25,-0.75) 45(-4.25,-1.25) 46(-4.25,-1.75) 47(-4.25,-2.25) 48(-4.25,-2.75)
R0603
  rect 0.806x0.864 smd: 1(-0.753,0) 2(0.753,0)
SMC_L7.1-W6.2-LS8.1-RD
  rect 3.03x3.82 smd: 1(-3.435,0) 2(3.435,0)
SOP-8_L4.9-W3.9-P1.27-LS6.0-TL-EP-1
  oval 1.27x0.508 smd: 1(-2.794,1.905) 2(-2.794,0.635) 3(-2.794,-0.635) 4(-2.794,-1.905) 5(2.794,-1.905) 6(2.794,-0.635) 7(2.794,0.635) 8(2.794,1.905)
  rect 2.4x3.3 smd: 9(0,0)
SOT-223-3_L6.5-W3.4-P2.30-LS7.0-BR
  rect 2.5x1.1 smd: 1(2.97,-2.3) 2(2.97,0) 3(2.97,2.3)
  rect 2.34x3.6 smd: 4(-2.97,0)
SSOP-24_L8.3-W5.6-P0.65-LS7.6-BL
  oval 0.308x1.324 smd: 1(-3.575,-3.562) 2(-2.925,-3.562) 3(-2.275,-3.562) 4(-1.625,-3.562) 5(-0.975,-3.562) 6(-0.325,-3.562) 7(0.325,-3.562) 8(0.975,-3.562) 9(1.625,-3.562) 10(2.275,-3.562) 11(2.925,-3.562) 12(3.575,-3.562) 13(3.575,3.562) 14(2.925,3.562) 15(2.275,3.562) 16(1.625,3.562) 17(0.975,3.562) 18(0.325,3.562) 19(-0.325,3.562) 20(-0.975,3.562) 21(-1.625,3.562) 22(-2.275,3.562) 23(-2.925,3.562) 24(-3.575,3.562)
SW-SMD_L6.0-W3.5-LS8.0
  rect 1.74x1.4 smd: 1(-3.67,0) 2(3.67,0)
SW-TH_SHOU-HAN_SS12D10G4
  oval 1.7x2.9 hole 1.1x2.3: 1(-4.8,0) 2(0,0) 3(4.8,0)

## Nets
+5V: C6.2 C7.2 C8.2 C9.2 C10.2 C11.2 C18.1 C24.1 CN1.5 H5.1 H5.2 H5.3 H5.4 H5.5 I2C_1.1 I2C_1.2 I2C_2.1 L1.2 NOREF.4 R1.2 U1.3 U4.19 U4.20
+12V: C2.2 C3.1 C4.1 C5.2 C16.1 H4.1 H4.2 H4.3 H4.4 H4.5 SW1.1 U2.7 U4.13 U4.14 U4.24
GND: C2.1 C3.2 C4.2 C5.1 C6.1 C7.1 C8.1 C9.1 C10.1 C11.1 C12.1 C13.1 C14.2 C15.2 C16.2 C17.2 C18.2 C19.1 C20.1 C21.1 C22.1 C24.2 CN1.2 D1.2 DC1.2 DC1.3 H6.1 H6.2 H6.3 H6.4 H6.5 I2C_1.5 I2C_2.4 KEY1.2 LED1.1 NOREF.1 R4.2 RST.1 U1.1 U2.6 U2.9 U3.8 U3.23 U3.35 U3.44 U3.47 U4.3 U4.4 U4.9 U4.10 U4.18
VCC3V3: C12.2 C13.2 C19.2 C20.2 C21.2 C22.2 R2.1 R5.2 R6.1 R7.1 U1.2 U1.4 U3.1 U3.9 U3.24 U3.36 U3.48
AIN1: U3.26 U4.21
AIN2: U3.25 U4.22
AO1: CN1.1 U4.1 U4.2
AO2: CN1.6 U4.5 U4.6
I2C1_SCL: I2C_1.4 U3.42
I2C1_SDA: I2C_1.3 U3.43
I2C2_SCL: I2C_2.3 U3.21
I2C2_SDA: I2C_2.2 U3.22
KEY1: KEY1.1 R6.2 U3.4
LED1: LED2.1 U3.3
NRST: C17.1 R5.1 RST.2 U3.7
OSC_IN: C14.1 U3.5 X1.3
OSC_OUT: C15.1 U3.6 X1.1
PA0: CN1.4 U3.10
PA1: CN1.3 U3.11
PA2: U3.12 串口.2
PA3: U3.13 串口.1
PA4: U3.14
PA5: U3.15
PA6: U3.16
PA7: U3.17
PA8: U3.29 U4.23
PA9: U3.30 串口.3
PA10: U3.31 串口.4
PA11: U3.32
PA12: U3.33
PA13: NOREF.3 U3.34
PA14: NOREF.2 U3.37
PA15: U3.38
PB0: U3.18
PB1: U3.19
PB2: U3.20
PB3: U3.39
PB4: U3.40
PB5: U3.41
PB8: U3.45
PB9: U3.46
PB14: U3.27
PB15: U3.28
$1N3060: LED1.2 R2.2
$1N3483: LED2.2 R7.2
$1N5689: R3.2 R4.1
$1N5690: R1.1 R3.1 U2.4
$1N5697: C1.2 U2.1
$1N5698: C1.1 D1.1 L1.1 U2.8
$1N7426: U3.2
$1N11600: DC1.1 SW1.2 SW1.3

Pads without a net: U2 2 3 5; U4 7 8 11 12 15 16 17; X1 2 4

## Via types
v1: diameter 0.61, hole 0.305, Top Layer to Bottom Layer, 24 vias
v2: diameter 1.219, hole 0.813, Top Layer to Bottom Layer, 2 vias

## Routing (per net, layer and track width the routed paths; a pad name or vN(x,y) marks a point on that pad's centre or on a via; arc(x,y) is an arc through that point)
+5V: length 40.3
  Top Layer w0.305: U4.20 U4.19 24.44,18.45 25.15,17.74 25.15,13.42 24.77,13.04 C18.1 7.24,13.04
  Top Layer w0.508: 42.15,32.73 42.15,33.48 42.42,33.74 43.54,33.74 R1.2 ; 42.15,32.73 U1.3 ; 42.15,32.73 52.83,32.73
  vias: v2(19.94,30.73) v2(25.15,30.7)
+12V: length 22.3
  Top Layer w0.508: 47.24,44.92 47.23,44.91 U2.7
  Top Layer w1.27: C2.2 33.71,44.54 27.3,44.54 26.67,43.9 26.67,34.76 25.93,34.02 SW1.1
GND: length 11.5
  Top Layer w0.305: U4.18 24.07,17.8 24.38,17.49 24.38,15.96 ; 37.08,11.77 36.69,12.17 U3.44 ; 33.66,16.73 33.69,16.76 U3.23 ; 37.97,11.77 38.19,11.99 U3.47
  vias: v1(26.8,24.6) v1(32,11.65) v1(34.54,32.98) v1(37.72,17.11) v1(41.78,13.68) v1(41.91,27.9) v1(46.74,15.71) v1(46.86,19.01) v1(50.29,35.01) v1(52.58,14.95)
VCC3V3: length 107.4
  Top Layer w0.305: R2.1 33.15,25.62 32.89,25.87 26.04,25.87 25.65,25.49 25.65,22.31 26.04,21.93 33.12,21.93 U3.24 ; 43.84,9.99 41.02,9.99 40.58,10.44 C19.2 38.99,11.65 38.69,11.94 U3.48 38.69,14.65 ; 43.84,9.99 43.82,10.01 R7.1 ; 43.84,9.99 48.32,9.99 ; 54.86,13.55 49.01,13.55 48.4,14.15 R5.2 ; 54.86,13.55 54.86,10.3 54.56,9.99 48.32,9.99 ; 54.86,13.55 54.86,24.35 54.36,24.85 44.53,24.85 U1.4 ; R6.1 48.4,10.07 48.32,9.99 ; U3.9 41.51,18.86 42.42,19.77 42.42,20.99 42.72,21.3 43.88,21.3 ; U3.1 33.32,14.86 31.69,13.23 C20.2 30.23,14.31 30.78,14.86 U3.36
  Top Layer w0.508: R2.1 33.16,24.98 35.58,24.98 35.81,25.21 C21.2 C13.2 C12.2 39.88,25.11 40.13,24.85 44.37,24.85 U1.4
AIN1: length 8.6
  Top Layer w0.305: U3.26 23.24,19.86 U4.21
AIN2: length 8.6
  Top Layer w0.305: U4.22 23.15,20.36 U3.25
AO1: length 7.7
  Top Layer w0.305: CN1.1 14.94,24.9 16,23.84 16,21.05 16,21.05
AO2: length 8.4
  Top Layer w0.305: U4.5 U4.6 14.04,18.45 13.84,18.25 13.84,15.12 13.54,14.82 11.56,14.82
I2C1_SCL: length 31
  Top Layer w0.305: U3.42 35.69,10.38 35.43,10.12 v1(33.91,10.12) ; v1(11.68,10.12) I2C_1.4
  Bottom Layer w0.305: v1(11.68,10.12) v1(33.91,10.12)
I2C1_SDA: length 34
  Top Layer w0.305: U3.43 36.19,9.48 35.81,9.11 v1(33.91,9.11) ; v1(9.14,9.11) I2C_1.3
  Bottom Layer w0.305: v1(9.14,9.11) v1(33.91,9.11)
I2C2_SCL: length 16.1
  Top Layer w0.305: U3.21 34.69,18.86 v1(35.43,18.12)
  Bottom Layer w0.305: v1(35.43,18.12) 35.43,7.84 35.05,7.45 I2C_2.3
I2C2_SDA: length 17.9
  Top Layer w0.305: U3.22 34.19,17.97 v1(34.8,17.36)
  Bottom Layer w0.305: I2C_2.2 32.51,7.96 32.77,8.22 34.54,8.22 34.8,8.47 v1(34.8,17.36)
KEY1: length 16.1
  Top Layer w0.305: KEY1.1 53.1,11.77 R6.2 49.9,12.54 49.53,12.92 47.12,12.92 46.61,13.42 46.61,14.57 46.1,15.07 44.45,15.07 43.16,16.36 U3.4
LED1: length 5.5
  Top Layer w0.305: U3.3 42.9,15.86 43.82,14.95 43.82,13.46 LED2.1
NRST: length 17.6
  Top Layer w0.305: U3.7 41.4,17.86 v1(41.66,18.12) ; v1(46.74,16.98) 47.24,16.47 52.7,16.47 53.23,16.99 RST.2
  Bottom Layer w0.305: v1(41.66,18.12) 46.36,18.12 46.74,17.74 46.74,17.11
OSC_IN: length 12
  Top Layer w0.305: X1.3 50.29,19.14 50.29,18.12 50.04,17.87 44.2,17.87 43.88,17.55 43.88,16.98 43.76,16.86 U3.5
OSC_OUT: length 11.6
  Top Layer w0.305: U3.6 42.3,17.36 42.55,17.61 42.55,18.88 42.8,19.14 43.88,19.14 43.88,19.71 44.2,20.03 46.61,20.03 46.86,20.28 46.86,21.04 47.12,21.3 48.47,21.3 X1.1
PA0: length 31.4
  Top Layer w0.305: v1(35.43,19.14) 35.66,19.36 U3.10
  Bottom Layer w0.305: CN1.4 24.37,18.9 24.89,18.38 24.89,17.61 25.45,17.06 29.16,17.06 29.85,17.74 29.85,18.76 30.23,19.14 v1(35.43,19.14)
PA1: length 32.9
  Top Layer w0.305: U3.11 35.72,19.86 v1(35.43,20.16)
  Bottom Layer w0.305: CN1.3 11.67,20.79 24.64,20.79 25.4,20.03 25.4,18.25 25.91,17.74 28.7,17.74 29.21,18.25 29.21,19.65 29.72,20.16 v1(35.43,20.16)
PA2: length 40.6
  Top Layer w0.305: U3.12 41.36,20.36 41.66,20.66 41.66,23.33 41.15,23.84 28.7,23.84 v1(28.45,23.58) ; 串口.2 20.83,7.84 21.46,8.47 25.4,8.47 26.54,9.61 26.54,17.61 v1(27.56,18.63)
  Bottom Layer w0.305: v1(28.45,23.58) 28.45,19.52 v1(27.56,18.63)
PA3: length 36.8
  Top Layer w0.305: v1(27.05,22.95) 27.18,22.82 28.7,22.82 29.08,23.2 38.35,23.2 38.69,22.87 U3.13 ; v1(26.29,18.88) 25.78,18.38 25.78,10.05 24.84,9.11 19.05,9.11 18.29,8.34 串口.1
  Bottom Layer w0.305: v1(26.29,18.88) 26.29,22.19 v1(27.05,22.95)
PA8: length 13.5
  Top Layer w0.305: 23.12,21.05 32.51,21.05 33.02,20.54 33.02,18.63 32.77,18.38 31.7,18.38 U3.29
PA9: length 18.6
  Top Layer w0.305: 串口.3 23.37,7.45 23.75,7.84 26.67,7.84 27.18,8.34 27.18,16.34 28.7,17.86 U3.30
PA10: length 15.9
  Top Layer w0.305: U3.31 31.69,17.36 29.08,17.36 27.81,16.09 27.81,6.69 27.3,6.18 串口.4
PA13: length 27.4
  Top Layer w0.305: NOREF.3 44.07,7.33 43.69,7.71 29.21,7.71 28.58,8.34 28.58,15.33 29.08,15.84 31.66,15.84 U3.34
PA14: length 20.1
  Top Layer w0.305: 46.61,6.18 46.61,7.84 46.1,8.34 33.53,8.34 33.19,8.68 U3.37
$1N3060: length 2
  Top Layer w0.508: LED1.2 29.63,24.99 R2.2
$1N3483: length 1.8
  Top Layer w0.305: R7.2 45.38,11.69 LED2.2
$1N5689: length 1.9
  Top Layer w0.508: R3.2 R4.1
$1N5690: length 8.1
  Top Layer w0.508: R1.1 R3.1 45.47,36.17 45.85,36.54 49.28,36.54 49.78,37.05 49.78,37.9 U2.4
$1N5697: length 2.3
  Top Layer w0.508: U2.1 43.86,37.91 C1.2
$1N5698: length 19
  Top Layer w0.508: D1.1 38.55,40.99 L1.1 43.75,40.68 43.75,40.68 ; 43.75,40.68 C1.1 ; 43.75,40.68 43.75,42.95 44.32,43.52 45.94,43.52 U2.8

## Copper pours and planes (outline as drawn; the poured copper is in the pictures)
+5V on Top Layer: 5.72,31.27 20.58,31.27 20.58,30.19 5.72,30.19
+5V on Top Layer: 24.64,31.27 28.83,31.27 28.83,30.19 24.64,30.19
+5V on Top Layer: 5.72,17.49 12.06,17.49 12.06,16.31 5.72,16.31
+5V on Top Layer: 3.17,7.07 7.49,7.07 7.49,5.3 3.17,5.3
+5V on Top Layer: 52.32,43.78 53.98,43.78 53.98,31.97 52.32,31.97
+5V on Top Layer: 27.06,31.14 42.69,31.14 42.69,30.35 27.06,30.35
+5V on Top Layer: 5.72,31.2 7.49,31.2 7.49,3.39 5.72,3.39
+5V on Top Layer: 29.08,7.07 30.86,7.07 30.86,3.39 29.08,3.39
+5V on Top Layer: 40.64,7.2 42.42,7.2 42.42,3.39 40.64,3.39
+5V on Top Layer: 5.72,4.91 42.42,4.91 42.42,3.39 5.72,3.39
+5V on Top Layer: 38.23,34.89 39.47,34.89 39.47,30.35 38.23,30.35
+5V on Bottom Layer: 19.3,31.27 25.82,31.27 25.82,30.19 19.3,30.19
+12V on Top Layer: 33.02,45.43 61.34,45.43 61.34,44.41 33.02,44.41
+12V on Top Layer: 59.69,45.43 61.34,45.43 61.34,31.97 59.69,31.97
+12V on Top Layer: 20.83,28.92 21.97,28.92 21.97,14.44 20.83,14.44
+12V on Top Layer: 22.48,28.68 23.75,28.68 23.75,21.55 22.48,21.55
+12V on Top Layer: 20.83,15.33 23.75,15.33 23.75,14.44 20.83,14.44
+12V on Top Layer: 21.21,34.63 24.26,34.63 24.26,27.9 21.21,27.9
GND on Top Layer: -1.02,51.27 66.29,51.27 66.29,-1.18 -1.02,-1.18
GND on Bottom Layer: -3.17,53.81 67.82,53.81 67.82,-2.83 -3.17,-2.83
VCC3V3 on Top Layer: 43.94,32.09 44.96,32.09 44.96,24.85 43.94,24.85
VCC3V3 on Top Layer: 43.5,25.08 44.2,25.08 44.2,20.92 43.5,20.92
$1N11600 on Top Layer: 20.95,44.79 24.64,44.79 24.64,37.3 20.95,37.3
$1N11600 on Top Layer: 15.88,40.98 24.64,40.98 24.64,37.3 15.88,37.3

Small or netless copper shapes (teardrops, artwork), in the pictures only: 101 on Top Layer, 18 on Bottom Layer

## Text on the board
Top Silkscreen Layer: +5V | SDA | SCL | GND | RX2 | TX2 | TX1 | RX1 | DIO | CLK | +12V
